# EAGLE design LEDmeterboard (EAGLE 6.6.0)
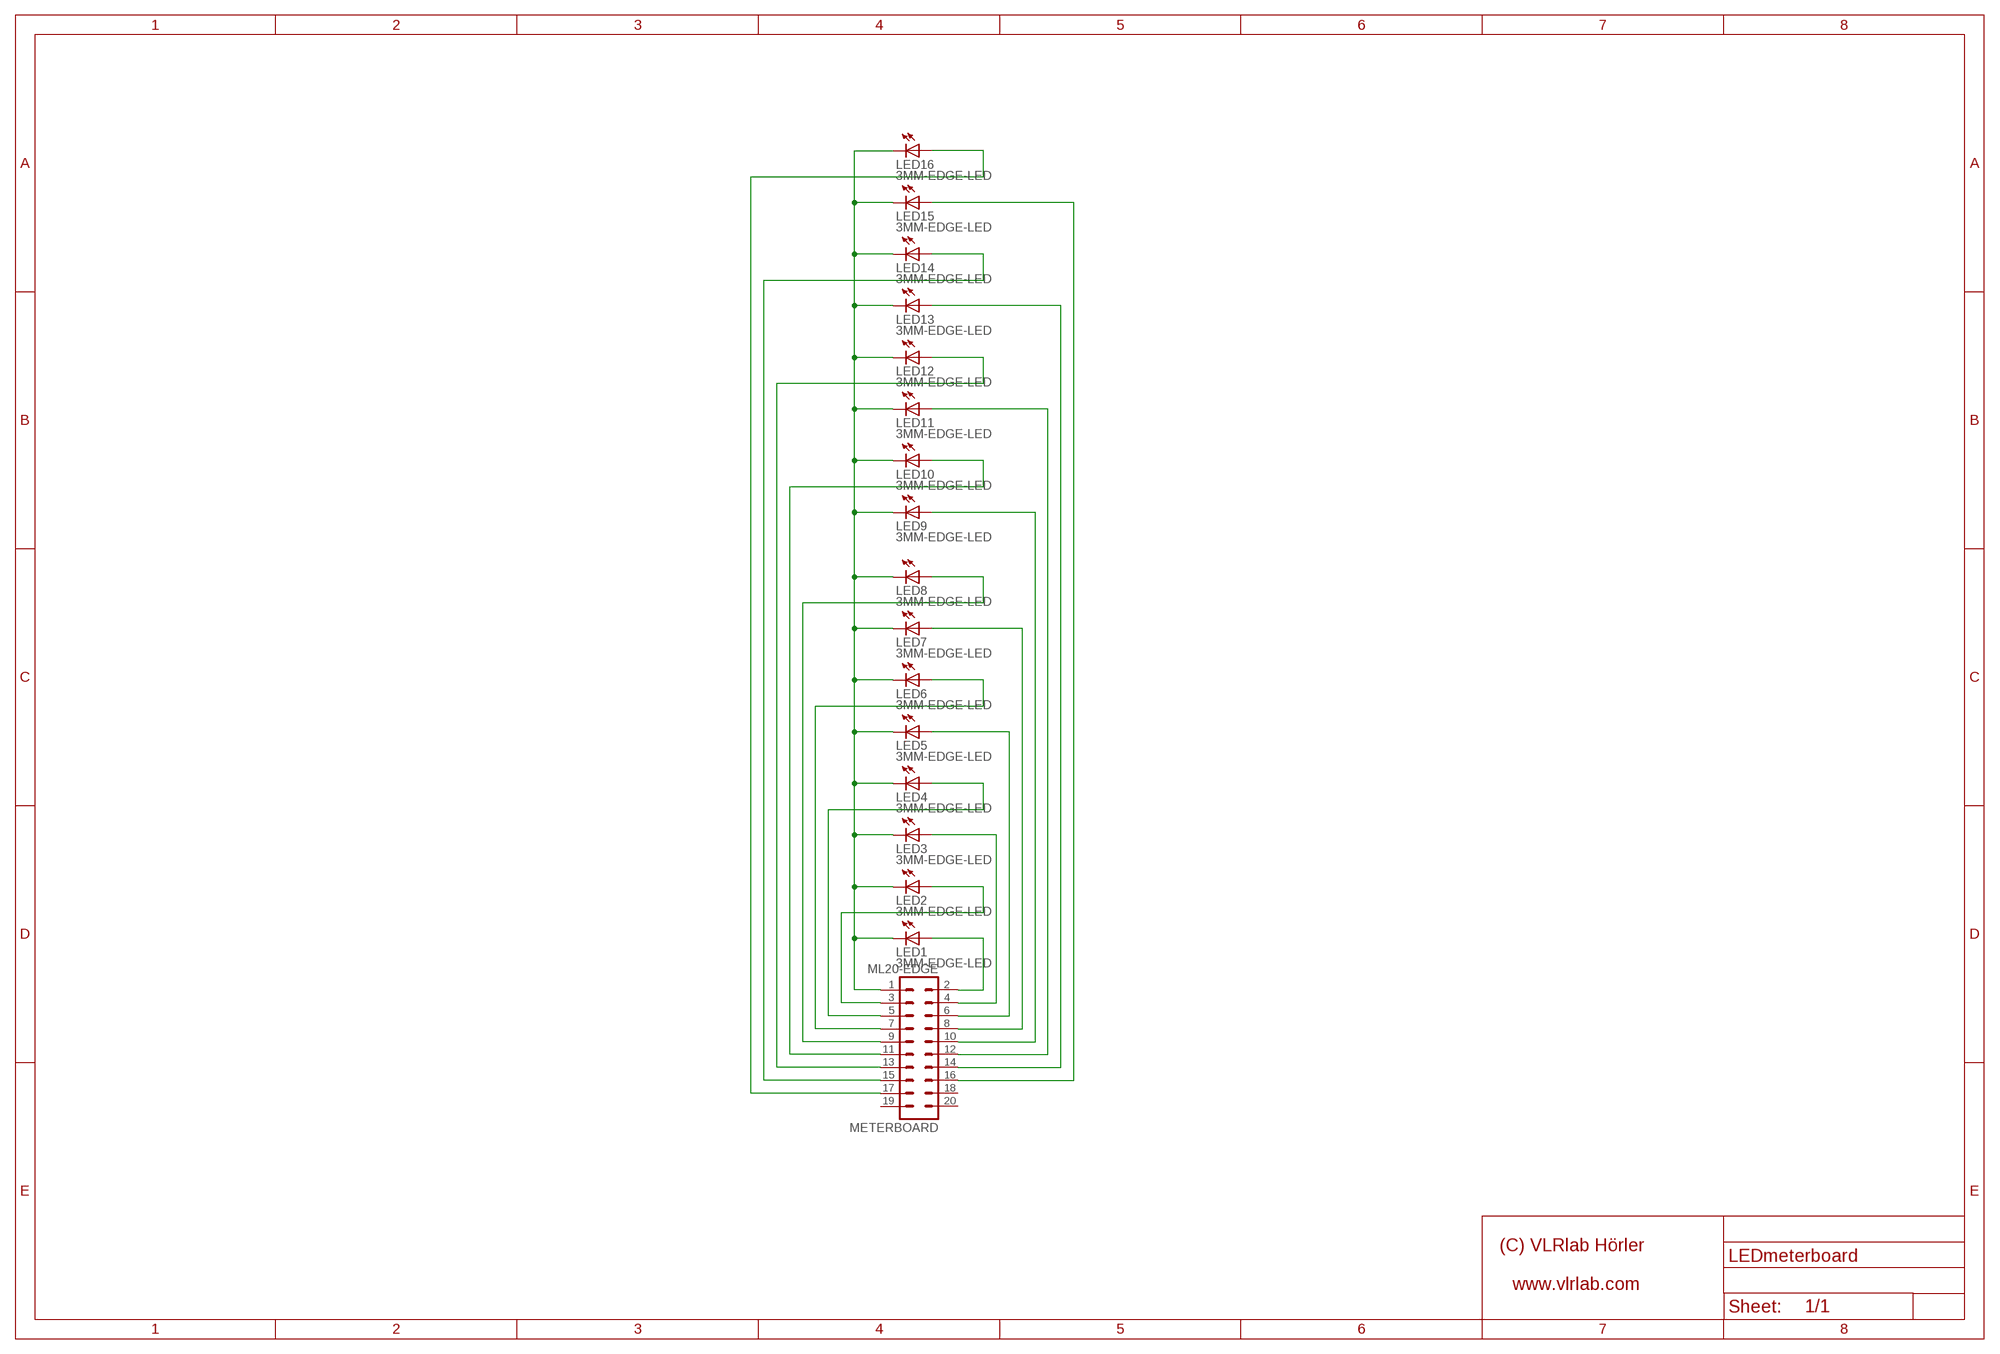
[diagram p0: schematic, sheet 1]

## Parts
LED1  3MM-EDGE-LED  [3MM-EDGE-LED]
LED2  3MM-EDGE-LED  [3MM-EDGE-LED]
LED3  3MM-EDGE-LED  [3MM-EDGE-LED]
LED4  3MM-EDGE-LED  [3MM-EDGE-LED]
LED5  3MM-EDGE-LED  [3MM-EDGE-LED]
LED6  3MM-EDGE-LED  [3MM-EDGE-LED]
LED7  3MM-EDGE-LED  [3MM-EDGE-LED]
LED8  3MM-EDGE-LED  [3MM-EDGE-LED]
LED9  3MM-EDGE-LED  [3MM-EDGE-LED]
LED10  3MM-EDGE-LED  [3MM-EDGE-LED]
LED11  3MM-EDGE-LED  [3MM-EDGE-LED]
LED12  3MM-EDGE-LED  [3MM-EDGE-LED]
LED13  3MM-EDGE-LED  [3MM-EDGE-LED]
LED14  3MM-EDGE-LED  [3MM-EDGE-LED]
LED15  3MM-EDGE-LED  [3MM-EDGE-LED]
LED16  3MM-EDGE-LED  [3MM-EDGE-LED]
METERBOARD  ML20-EDGE  [ML20EDGE]

## Nets
N$1: LED1.KATHODE(C) LED2.KATHODE(C) LED3.KATHODE(C) LED4.KATHODE(C) LED5.KATHODE(C) LED6.KATHODE(C) LED7.KATHODE(C) LED8.KATHODE(C) LED9.KATHODE(C) LED10.KATHODE(C) LED11.KATHODE(C) LED12.KATHODE(C) LED13.KATHODE(C) LED14.KATHODE(C) LED15.KATHODE(C) LED16.KATHODE(C) METERBOARD.1
N$2: LED1.ANODE(A) METERBOARD.2
N$3: LED2.ANODE(A) METERBOARD.3
N$4: LED3.ANODE(A) METERBOARD.4
N$5: LED4.ANODE(A) METERBOARD.5
N$6: LED5.ANODE(A) METERBOARD.6
N$7: LED6.ANODE(A) METERBOARD.7
N$8: LED7.ANODE(A) METERBOARD.8
N$9: LED8.ANODE(A) METERBOARD.9
N$10: LED9.ANODE(A) METERBOARD.10
N$11: LED10.ANODE(A) METERBOARD.11
N$12: LED11.ANODE(A) METERBOARD.12
N$13: LED12.ANODE(A) METERBOARD.13
N$14: LED13.ANODE(A) METERBOARD.14
N$15: LED14.ANODE(A) METERBOARD.15
N$16: LED15.ANODE(A) METERBOARD.16
N$17: LED16.ANODE(A) METERBOARD.17
Unconnected: METERBOARD.18 METERBOARD.19 METERBOARD.20

## Library data of the parts
LED1-LED16 = led:3MM-EDGE-LED
METERBOARD = con-ml_Ivan:ML20-EDGE

## Board
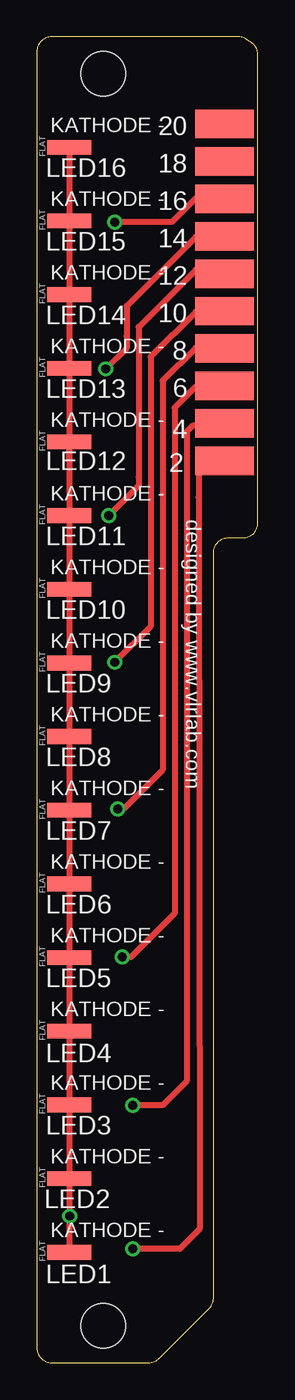
[diagram p1: board, top side]
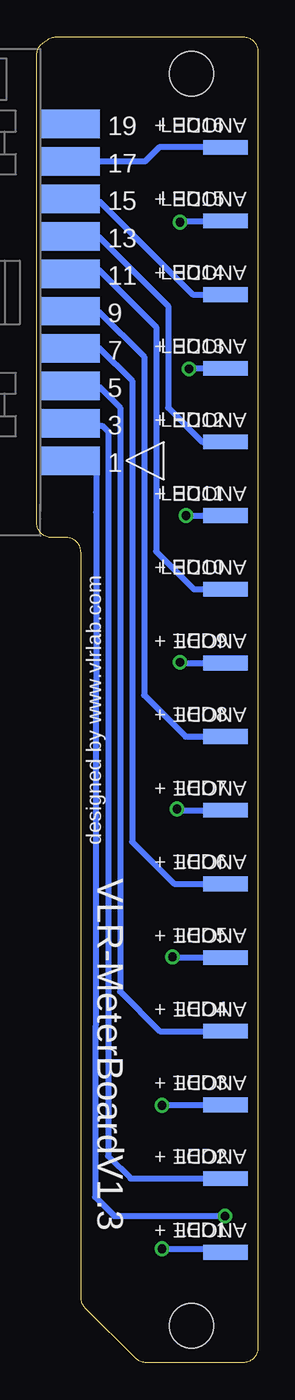
[diagram p2: board, bottom side, seen from below]

Size 15 x 90 mm. Coordinates in mm from the lower left corner, seen from the top.
Outline: 0,89 0,1 arc90 1,0 7.59,0 arc45 8.29,0.29 11.71,3.71 arc45 12,4.41 12,5 12,55 arc-90 13,56 14,56 arc90 15,57 15,88.78 arc55 14.57,89.6 14.26,89.82 arc35 13.69,90 1,90 arc90 0,89
Copper layers (1*16): Top 0.035mm / dielectric 1.5mm / Bottom 0.035mm
Design rules "default *": minimum track width 10mil, minimum drill 13mil, track to track 8mil, track to pad 8mil, pad to pad 8mil, via to via 8mil, smd to smd 8mil, copper to edge 10mil, drill to drill 10mil, minimum pad ring 10mil, minimum via ring 8mil, stop-mask expansion 4mil, vias tented up to drill 0mil, thermal gap 0mil
Holes 3 mm at 4.5,2.5 4.5,87.5

### Footprints (pad centres in the part's own frame; a part is rotated, then mirrored left to right if it is on the bottom)
3MM-EDGE-LED = smd 3 x 1 bottom: ANODE 2,0 | smd 3 x 1: KATHODE 2,0
ML20EDGE = smd 4 x 1.93: 1 0,-11.43; 3 0,-8.89; 5 0,-6.35; 7 0,-3.81; 9 0,-1.27; 11 0,1.27; 13 0,3.81; 15 0,6.35; 17 0,8.89; 19 0,11.43 | smd 4 x 1.93 bottom: 2 0,-11.43; 4 0,-8.89; 6 0,-6.35; 8 0,-3.81; 10 0,-1.27; 12 0,1.27; 14 0,3.81; 16 0,6.35; 18 0,8.89; 20 0,11.43

### Placement (x,y rotation side)
LED1  0.2,7.5 0 top
LED2  0.2,12.5 0 top
LED3  0.2,17.5 0 top
LED4  0.2,22.5 0 top
LED5  0.2,27.5 0 top
LED6  0.2,32.5 0 top
LED7  0.2,37.5 0 top
LED8  0.2,42.5 0 top
LED9  0.2,47.5 0 top
LED10  0.2,52.5 0 top
LED11  0.2,57.5 0 top
LED12  0.2,62.5 0 top
LED13  0.2,67.5 0 top
LED14  0.2,72.5 0 top
LED15  0.2,77.5 0 top
LED16  0.2,82.5 0 top
METERBOARD  12.73,72.65 0 bottom

### Tracks (layer width: path | path; a pad name or v marks a point on that pad's centre or on a via)
N$1  (via drill 0.6)
  Top 0.406: LED16.KATHODE LED15.KATHODE LED14.KATHODE LED13.KATHODE LED12.KATHODE | LED12.KATHODE 2.2,61.16 | 2.2,61.16 LED12.KATHODE | 2.2,61.16 LED11.KATHODE LED10.KATHODE LED9.KATHODE LED8.KATHODE LED7.KATHODE LED6.KATHODE LED5.KATHODE LED4.KATHODE LED3.KATHODE LED2.KATHODE LED1.KATHODE 2.23,7.5 v2.23,9.96
  Bottom 0.406: METERBOARD.1 12.68,61.16 10.97,61.16 10.97,57.71 11.05,11.25 9.75,9.96 v2.23,9.96 2.2,9.96
N$2  (via drill 0.6)
  Top 0.406: METERBOARD.2 10.97,61.22 10.97,58.73 11.05,9.08 9.7,7.72 v6.5,7.72
  Bottom 0.406: v6.5,7.72 2.42,7.72 LED1.ANODE
N$3
  Bottom 0.406: METERBOARD.3 12.57,63.6 10.57,63.6 10.16,63.2 10.16,14.02 8.64,12.5 LED2.ANODE
N$4  (via drill 0.6)
  Top 0.406: METERBOARD.4 12.57,63.6 10.57,63.6 10.16,63.2 10.16,19.1 8.53,17.48 v6.5,17.48
  Bottom 0.406: v6.5,17.48 6.48,17.5 LED3.ANODE
N$5
  Bottom 0.406: METERBOARD.5 12.68,66.24 10.77,66.24 9.35,64.82 9.35,25.2 6.65,22.5 LED4.ANODE 2.2,22.55
N$6  (via drill 0.6)
  Top 0.406: METERBOARD.6 12.68,66.24 10.77,66.24 9.35,64.82 9.35,30.48 6.4,27.54 v5.79,27.54
  Bottom 0.406: v5.79,27.54 5.76,27.5 LED5.ANODE
N$7
  Bottom 0.406: METERBOARD.7 12.69,68.89 10.77,68.89 8.53,66.65 8.53,35.36 5.68,32.5 LED6.ANODE
N$8  (via drill 0.6)
  Top 0.406: METERBOARD.8 12.69,68.89 10.77,68.89 8.53,66.65 8.53,40.23 5.89,37.59 v5.49,37.59
  Bottom 0.406: v5.49,37.59 5.39,37.5 LED7.ANODE
N$9
  Bottom 0.406: METERBOARD.9 12.68,71.32 10.77,71.32 7.72,68.28 7.72,45.31 4.91,42.5 LED8.ANODE
N$10  (via drill 0.6)
  Top 0.406: METERBOARD.10 12.68,71.32 10.77,71.32 7.72,68.28 7.72,49.99 v5.28,47.55
  Bottom 0.406: v5.28,47.55 5.23,47.5 LED9.ANODE
N$11
  Bottom 0.406: METERBOARD.11 12.48,74.17 10.77,74.17 6.91,70.31 6.91,55.07 4.34,52.5 LED10.ANODE
N$12  (via drill 0.6)
  Top 0.406: METERBOARD.12 12.48,74.17 10.77,74.17 6.91,70.31 6.91,60.15 6.91,59.54 v4.88,57.51
  Bottom 0.406: v4.88,57.51 v4.87,57.5 LED11.ANODE
N$13
  Bottom 0.406: METERBOARD.13 12.68,76.4 10.77,76.4 6.1,71.73 6.1,64.82 3.77,62.5 LED12.ANODE
N$14  (via drill 0.6)
  Top 0.406: METERBOARD.14 12.68,76.4 10.77,76.4 6.1,71.73 6.1,69.7 6.1,68.89 v4.67,67.46
  Bottom 0.406: v4.67,67.46 4.64,67.5 LED13.ANODE
N$15
  Bottom 0.406: METERBOARD.15 12.57,78.84 10.77,78.84 4.43,72.5 LED14.ANODE
N$16  (via drill 0.6)
  Top 0.406: METERBOARD.16 12.69,79.05 10.77,79.05 9.14,77.42 v5.28,77.42
  Bottom 0.406: v5.28,77.42 5.2,77.5 LED15.ANODE
N$17
  Bottom 0.406: LED16.ANODE 6.71,82.5 7.67,81.54 METERBOARD.17

### Text on the board
tNames: designed by www.vlrlab.com
bNames: LED16 | LED15 | LED14 | LED13 | LED12 | LED11 | LED10 | LED9 | LED8 | LED7 | designed by www.vlrlab.com | LED6 | VLR-MeterBoardV1.3 | LED5 | LED4 | LED3 | LED2 | LED1